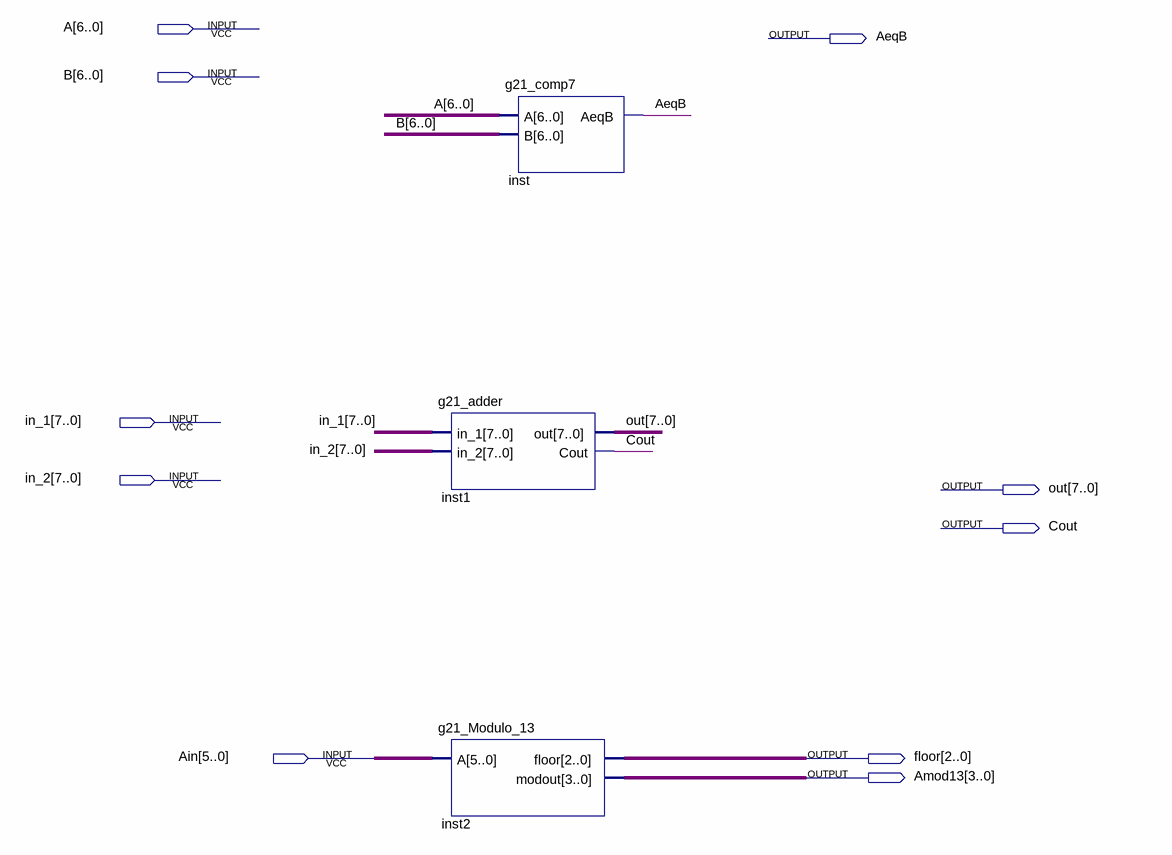
[diagram p0: schematic sheet]
// Quartus schematic g21_lab1.bdf as structural Verilog: 3 symbols, 10 pins
module g21_lab1 (
  input  [6:0] A,
  input  [6:0] B,
  input  [7:0] in_1,
  input  [7:0] in_2,
  input  [5:0] Ain,
  output AeqB,
  output [7:0] out,
  output Cout,
  output [2:0] floor,
  output [3:0] Amod13
);

  g21_adder inst1 (.in_1(in_1), .in_2(in_2), .out(out), .Cout(Cout));
  g21_Modulo_13 inst2 (.A(Ain), .floor(floor), .modout(Amod13));
  g21_comp7 inst (.A(A), .B(B), .AeqB(AeqB));
endmodule
